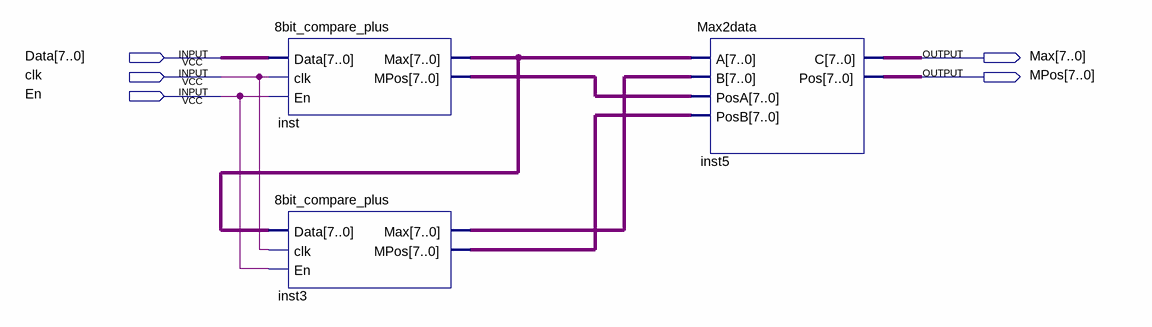
[diagram p0: schematic sheet]
// Quartus schematic 8bit_compare.bdf as structural Verilog: 3 symbols, 5 pins
module \8bit_compare  (
  input  [7:0] Data,
  input  clk,
  input  En,
  output [7:0] Max,
  output [7:0] MPos
);

  wire [7:0] inst3_max, inst3_mpos, inst_max, inst_mpos;

  \8bit_compare_plus  inst (.Data(Data), .clk(clk), .En(En), .Max(inst_max), .MPos(inst_mpos));
  \8bit_compare_plus  inst3 (.Data(inst_max), .clk(clk), .En(En), .Max(inst3_max), .MPos(inst3_mpos));
  Max2data inst5 (.A(inst_max), .B(inst3_max), .PosA(inst_mpos), .PosB(inst3_mpos), .C(Max), .Pos(MPos));
endmodule
